# EAGLE design serparallel (EAGLE 6.1)
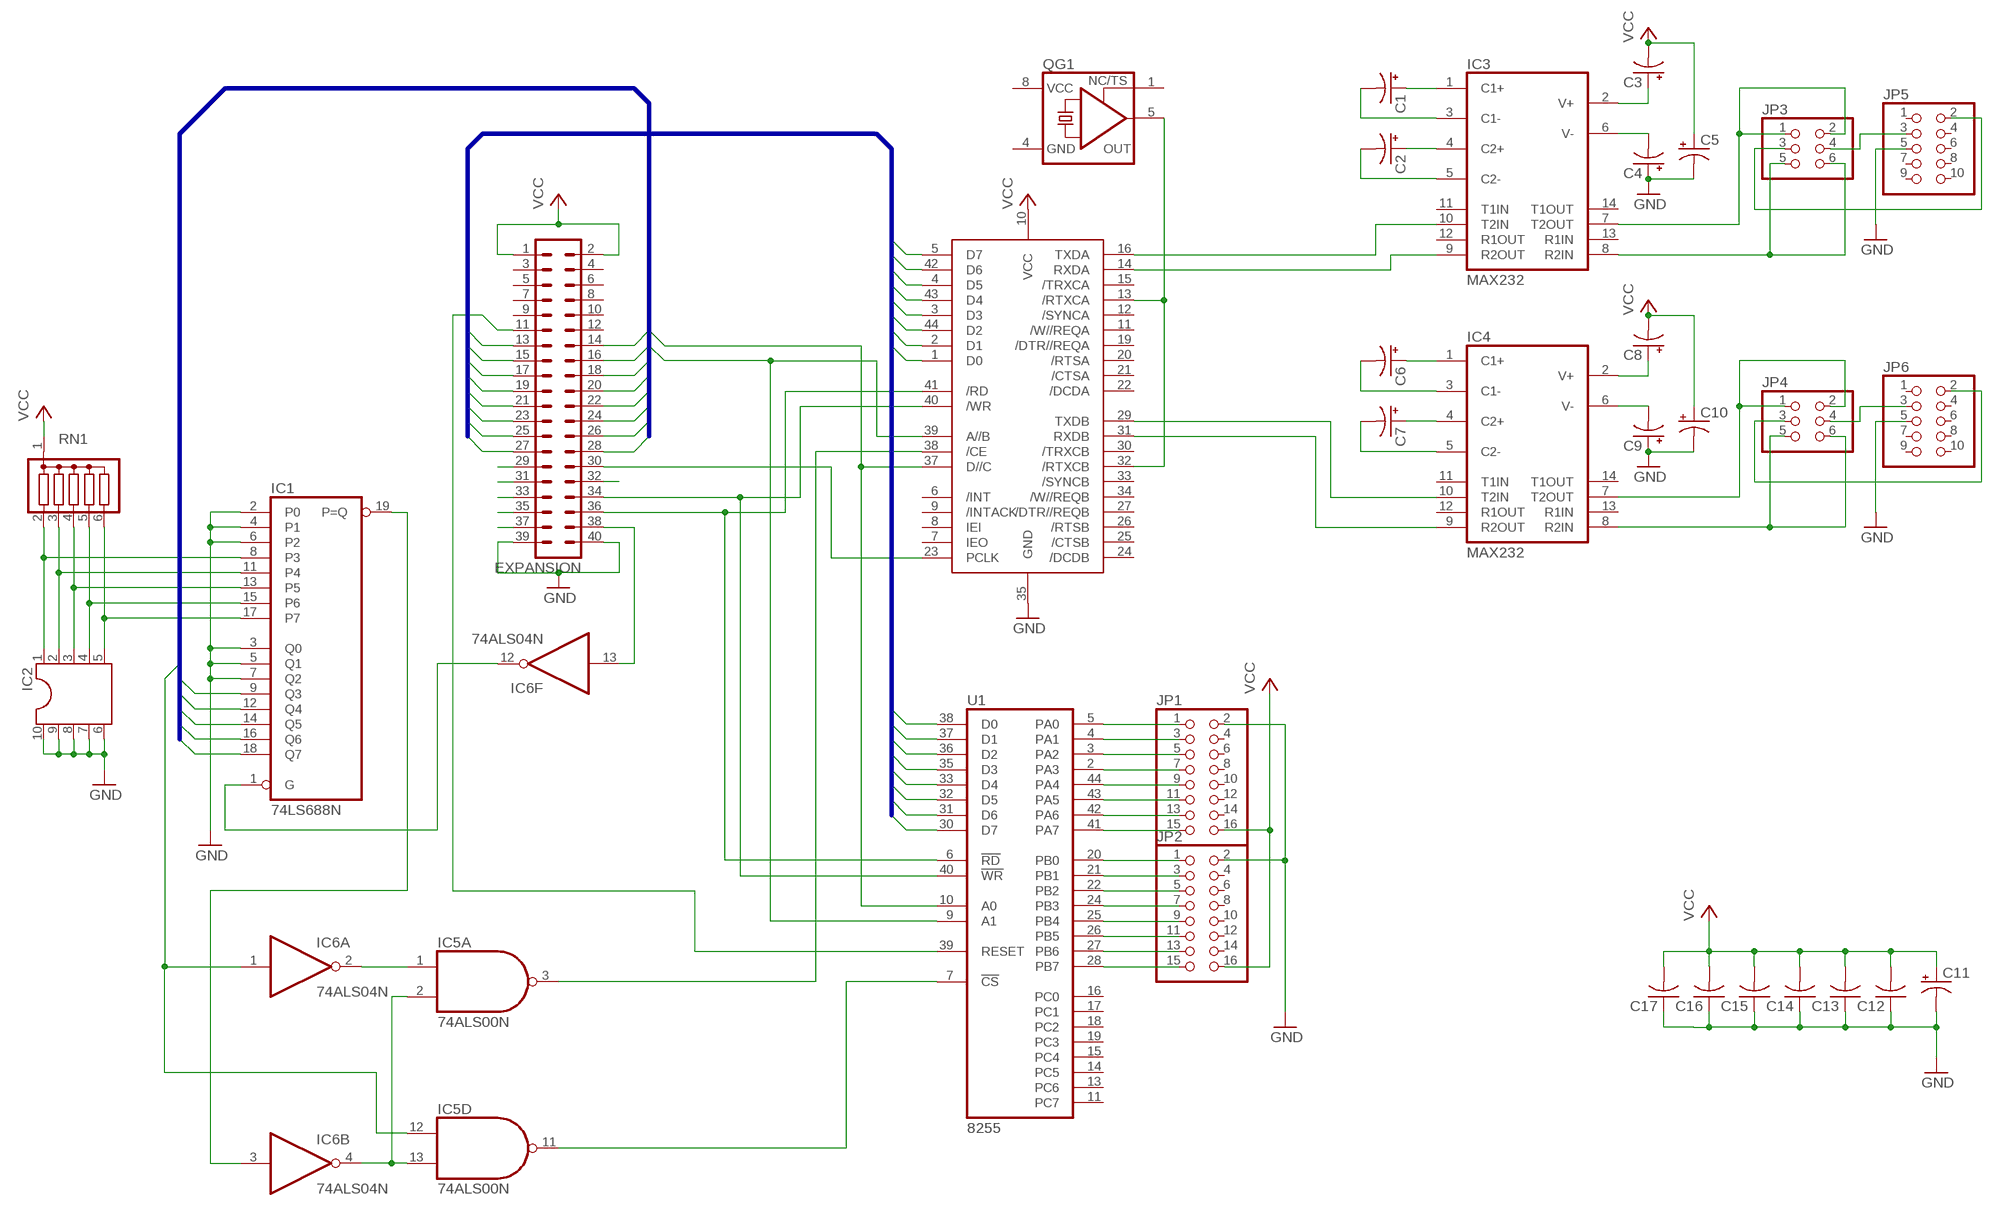
[diagram p0: schematic, sheet 1]

## Parts
C1  CPOL-USE2,5-6E  [E2,5-6E]
C2  CPOL-USE2,5-6E  [E2,5-6E]
C3  CPOL-USE2,5-6E  [E2,5-6E]
C4  CPOL-USE2,5-6E  [E2,5-6E]
C5  CPOL-USE2,5-6E  [E2,5-6E]
C6  CPOL-USE2,5-6E  [E2,5-6E]
C7  CPOL-USE2,5-6E  [E2,5-6E]
C8  CPOL-USE2,5-6E  [E2,5-6E]
C9  CPOL-USE2,5-6E  [E2,5-6E]
C10  CPOL-USE2,5-6E  [E2,5-6E]
C11  CPOL-USE15-6AXIAL  [E15-6]
C12  C-US075-032X103  [C075-032X103]
C13  C-US075-032X103  [C075-032X103]
C14  C-US075-032X103  [C075-032X103]
C15  C-US075-032X103  [C075-032X103]
C16  C-US075-032X103  [C075-032X103]
C17  C-US075-032X103  [C075-032X103]
EXPANSION  MA20-2W  [MA20-2W]
IC1  74LS688N  [DIL20]
IC2  DIL10  [DIL10]
IC3  MAX232  [DIL16]
IC4  MAX232  [DIL16]
IC5  74ALS00N  [DIL14]
IC6  74ALS04N  [DIL14]
JP1  PINHD-2X8/90  [2X08/90]
JP2  PINHD-2X8/90  [2X08/90]
JP3  PINHD-2X3  [2X03]
JP4  PINHD-2X3  [2X03]
JP5  PINHD-2X5/90  [2X05/90]
JP6  PINHD-2X5/90  [2X05/90]
QG1  XO-8  [DIL08S]
RN1  G05R  [SIL6]
U1  8255  82C55APLCC44  [S44]
U2  Z8530  [S44]

## Nets
/RD: EXPANSION.36 U1.6(!RD) U2.41(/RD)
/WR: EXPANSION.34 U1.40(!WR) U2.40(/WR)
ADDRESS8: EXPANSION.14 U1.10(A0) U2.37(D//C)
ADDRESS9: EXPANSION.16 U1.9(A1) U2.39(A//B)
ADDRESS10: EXPANSION.18 IC5.12(D:I0) IC6.1(A:I)
ADDRESS11: EXPANSION.20 IC1.9(Q3)
ADDRESS12: EXPANSION.22 IC1.12(Q4)
ADDRESS13: EXPANSION.24 IC1.14(Q5)
ADDRESS14: EXPANSION.26 IC1.16(Q6)
ADDRESS15: EXPANSION.28 IC1.18(Q7)
ALE: EXPANSION.32
CLKOUT: EXPANSION.30 U2.23(PCLK)
DATA0: EXPANSION.27 U1.38(D0) U2.1(D0)
DATA1: EXPANSION.25 U1.37(D1) U2.2(D1)
DATA2: EXPANSION.23 U1.36(D2) U2.44(D2)
DATA3: EXPANSION.21 U1.35(D3) U2.3(D3)
DATA4: EXPANSION.19 U1.33(D4) U2.43(D4)
DATA5: EXPANSION.17 U1.32(D5) U2.4(D5)
DATA6: EXPANSION.15 U1.31(D6) U2.42(D6)
DATA7: EXPANSION.13 U1.30(D7) U2.5(D7)
GND: C4.+ C5.- C9.+ C10.- C11.- C12.1 C13.1 C14.1 C15.1 C16.1 C17.1 EXPANSION.39 EXPANSION.40 IC1.2(P0) IC1.3(Q0) IC1.4(P1) IC1.5(Q1) IC1.6(P2) IC1.7(Q2) IC2.6 IC2.7 IC2.8 IC2.9 IC2.10 JP1.2 JP2.2 JP5.5 JP6.5 U2.35(GND)
INTBUS0: EXPANSION.37
INTBUS1: EXPANSION.35
INTBUS2: EXPANSION.33
INTBUS3: EXPANSION.31
INTBUS4: EXPANSION.29
IO/M: EXPANSION.38 IC6.13(F:I)
N$1: IC1.8(P3) IC2.1 RN1.2
N$2: IC1.11(P4) IC2.2 RN1.3
N$3: IC1.13(P5) IC2.3 RN1.4
N$4: IC1.15(P6) IC2.4 RN1.5
N$5: IC1.17(P7) IC2.5 RN1.6
N$6: IC5.1(A:I0) IC6.2(A:O)
N$7: IC5.2(A:I1) IC5.13(D:I1) IC6.4(B:O)
N$9: C1.+ IC3.1(C1+)
N$10: C1.- IC3.3(C1-)
N$11: C2.+ IC3.4(C2+)
N$12: C2.- IC3.5(C2-)
N$13: C3.+ IC3.2(V+)
N$14: C4.- IC3.6(V-)
N$15: C6.+ IC4.1(C1+)
N$16: IC5.3(A:O) U2.38(/CE)
N$17: C6.- IC4.3(C1-)
N$18: C7.+ IC4.4(C2+)
N$19: C7.- IC4.5(C2-)
N$20: C8.+ IC4.2(V+)
N$21: C9.- IC4.6(V-)
N$22: QG1.5(OUT) U2.13(/RTXCA) U2.32(/RTXCB)
N$23: IC3.10(T2IN) U2.16(TXDA)
N$24: IC3.9(R2OUT) U2.14(RXDA)
N$25: JP3.4 JP5.3
N$26: JP3.3 JP5.2
N$27: IC3.8(R2IN) JP3.5 JP3.6
N$28: JP1.1 U1.5(PA0)
N$29: IC3.7(T2OUT) JP3.1 JP3.2
N$30: JP1.3 U1.4(PA1)
N$31: JP1.5 U1.3(PA2)
N$32: JP1.7 U1.2(PA3)
N$33: JP1.9 U1.44(PA4)
N$34: JP1.11 U1.43(PA5)
N$35: JP1.13 U1.42(PA6)
N$36: JP1.15 U1.41(PA7)
N$37: JP2.1 U1.20(PB0)
N$38: JP2.3 U1.21(PB1)
N$39: JP2.5 U1.22(PB2)
N$40: JP2.7 U1.24(PB3)
N$41: JP2.9 U1.25(PB4)
N$42: JP2.11 U1.26(PB5)
N$43: JP2.13 U1.27(PB6)
N$44: JP2.15 U1.28(PB7)
N$45: IC5.11(D:O) U1.7(!CS)
N$47: IC1.19(P=Q) IC6.3(B:I)
N$49: IC1.1(G) IC6.12(F:O)
N$53: JP4.4 JP6.3
N$54: JP4.3 JP6.2
N$55: IC4.7(T2OUT) JP4.1 JP4.2
N$56: IC4.8(R2IN) JP4.5 JP4.6
N$57: IC4.10(T2IN) U2.29(TXDB)
N$58: IC4.9(R2OUT) U2.31(RXDB)
RESOUT: EXPANSION.11 U1.39(RESET)
VCC: C3.- C5.+ C8.- C10.+ C11.+ C12.2 C13.2 C14.2 C15.2 C16.2 C17.2 EXPANSION.1 EXPANSION.2 JP1.16 JP2.16 RN1.1 U2.10(VCC)
Unconnected: EXPANSION.3 EXPANSION.4 EXPANSION.5 EXPANSION.6 EXPANSION.7 EXPANSION.8 EXPANSION.9 EXPANSION.10 EXPANSION.12 IC3.11(T1IN) IC3.12(R1OUT) IC3.13(R1IN) IC3.14(T1OUT) IC4.11(T1IN) IC4.12(R1OUT) IC4.13(R1IN) IC4.14(T1OUT) IC5.4(B:I0) IC5.5(B:I1) IC5.6(B:O) IC5.8(C:O) IC5.9(C:I0) IC5.10(C:I1) IC6.5(C:I) IC6.6(C:O) IC6.8(D:O) IC6.9(D:I) IC6.10(E:O) IC6.11(E:I) JP1.4 JP1.6 JP1.8 JP1.10 JP1.12 JP1.14 JP2.4 JP2.6 JP2.8 JP2.10 JP2.12 JP2.14 JP5.1 JP5.4 JP5.6 JP5.7 JP5.8 JP5.9 JP5.10 JP6.1 JP6.4 JP6.6 JP6.7 JP6.8 JP6.9 JP6.10 QG1.1(TS) U1.11(PC7) U1.13(PC6) U1.14(PC5) U1.15(PC4) U1.16(PC0) U1.17(PC1) U1.18(PC2) U1.19(PC3) U2.6(/INT) U2.7(IEO) U2.8(IEI) U2.9(/INTACK) U2.11(/W//REQA) U2.12(/SYNCA) U2.15(/TRXCA) U2.19(/DTR//REQA) U2.20(/RTSA) U2.21(/CTSA) U2.22(/DCDA) U2.24(/DCDB) U2.25(/CTSB) U2.26(/RTSB) U2.27(/DTR//REQB) U2.30(/TRXCB) U2.33(/SYNCB) U2.34(/W//REQB)

## Buses
DATA
ADDRESS

## Power pins joined to a net without a drawn wire
GND: IC1.10(GND) IC3.15(GND) IC4.15(GND) IC5.7(P:GND) IC6.7(P:GND) QG1.4(GND) U1.8(GND)
VCC: IC1.20(VCC) IC3.16(VCC) IC4.16(VCC) IC5.14(P:VCC) IC6.14(P:VCC) QG1.8(VCC) U1.29(VCC)

## Library data of the parts
C1-C11 = resistor:CPOL-US: POLARIZED CAPACITOR, American symbol
C12-C17 = resistor:C-US: CAPACITOR, American symbol
EXPANSION = con-lstb:MA20-2W: PIN HEADER
IC1 = 74xx-us:74*688: 8-bit MAGNITUDE/IDENTITY COMPARATOR, totem pole
IC2 = ic-package:DIL10: Dual In Line / Socket
IC3 IC4 = maxim:MAX232: RS232 TRANSEIVER
IC5 = 74xx-us:74*00: Quad 2-input NAND gate
IC6 = 74xx-us:74*04: Hex INVERTER
JP1 JP2 = pinhead:PINHD-2X8: PIN HEADER
JP3 JP4 = pinhead:PINHD-2X3: PIN HEADER
JP5 JP6 = pinhead:PINHD-2X5: PIN HEADER
QG1 = crystal:XO-: CRYSTAL
RN1 = resistor-sil:G05R: SIL RESISTOR
U1 = plcc-socketed-devs:82C55A: MICROCONTROLLER/MEMORY DEVICE
U2 = plcc-socketed-devs:Z8530: Zilog 8530 SCC in PLCC socket

## Board
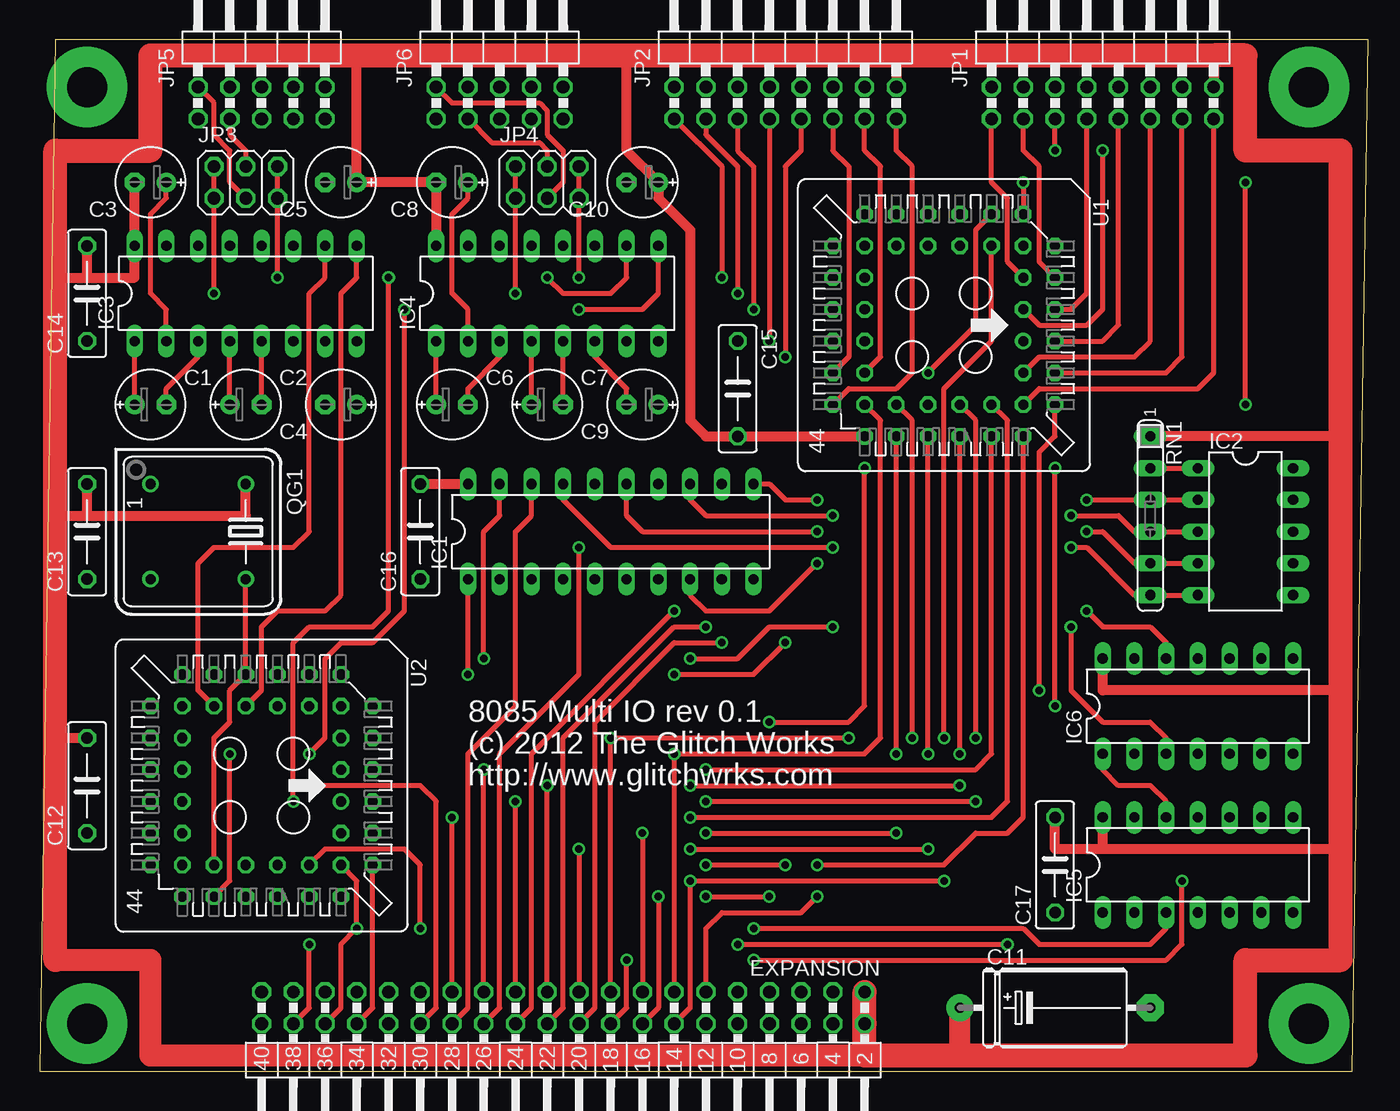
[diagram p1: board, top side]
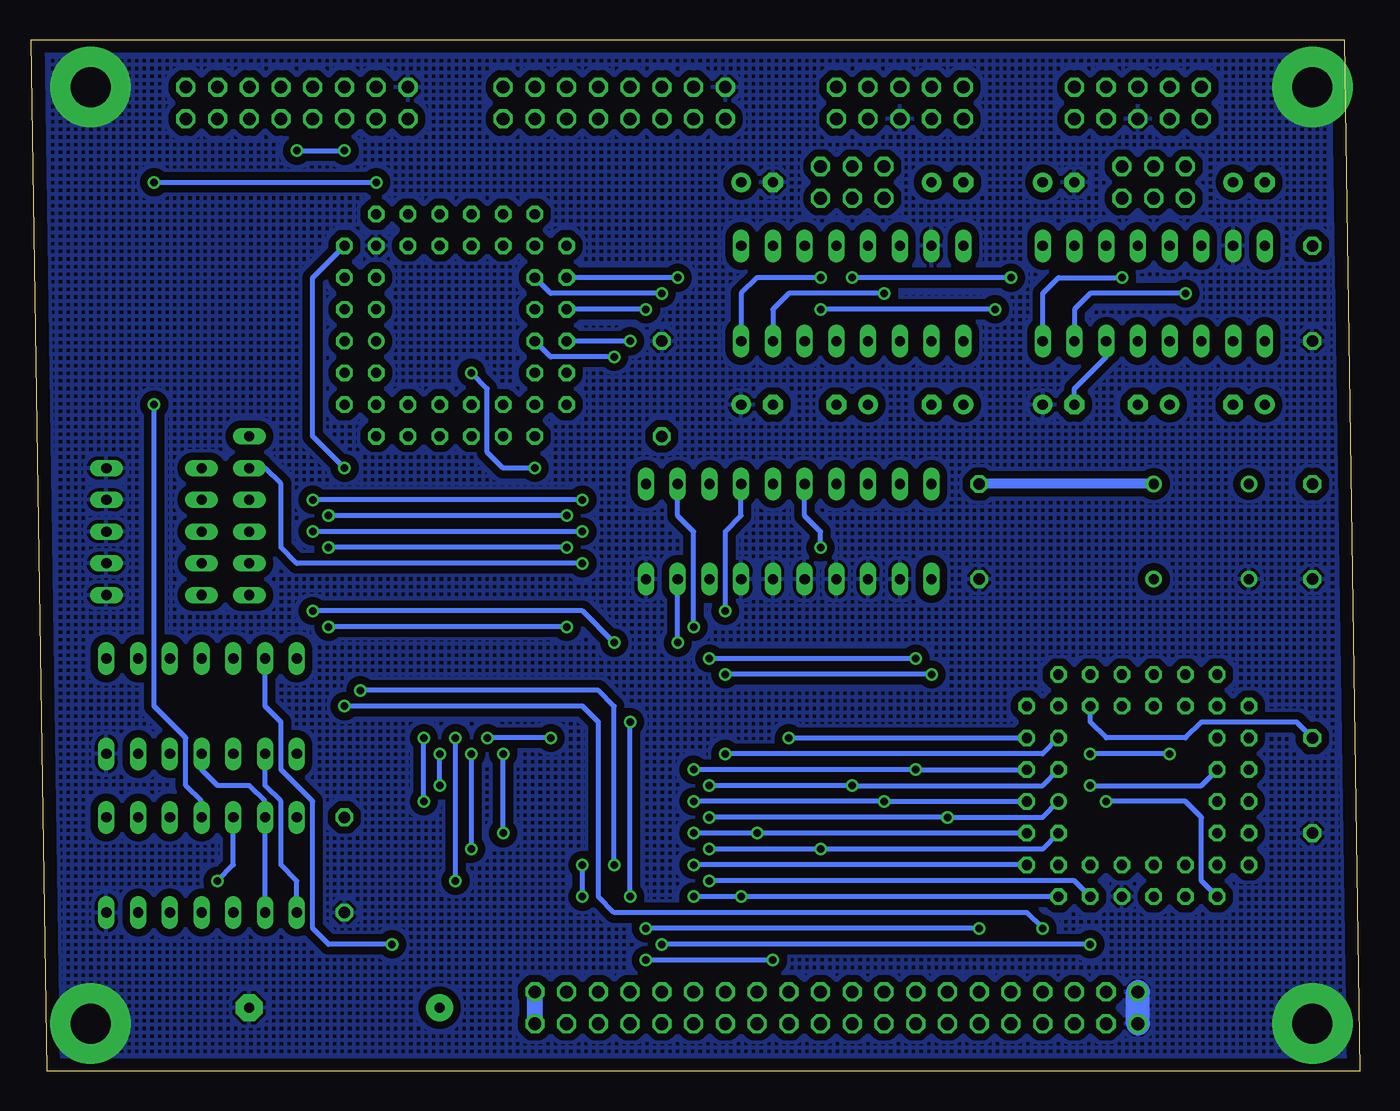
[diagram p2: board, bottom side, seen from below]

Size 106.35 x 82.54 mm. Coordinates in mm from the lower left corner, seen from the top.
Outline: 0,0 105.08,0 106.35,82.54 1.27,82.54 0,0
Copper layers (1*16): Top 0.035mm / dielectric 1.5mm / Bottom 0.035mm
Design rules: minimum track width 10mil, minimum drill 15mil, track to track 8mil, track to pad 8mil, pad to pad 8mil, via to via 8mil, smd to smd 8mil, copper to edge 40mil, drill to drill 8mil, minimum pad ring 10mil, minimum via ring 8mil, stop-mask expansion 4mil, vias tented up to drill 0mil, thermal gap 10mil

### Footprints (pad centres in the part's own frame; a part is rotated, then mirrored left to right if it is on the bottom)
E2,5-6E = drill 0.813 pad 1.575: + -1.27,0 | drill 0.813 pad 1.575 octagon: - 1.27,0
E15-6 = drill 0.813 pad 2.159: + -7.62,0 | drill 0.813 pad 2.159 octagon: - 7.62,0
C075-032X103 = drill 0.914 octagon: 1 -3.81,0; 2 3.81,0
MA20-2W = drill 1.016 octagon: 1 -24.13,-1.27; 2 -24.13,1.27; 3 -21.59,-1.27; 4 -21.59,1.27; 5 -19.05,-1.27; 6 -19.05,1.27; 7 -16.51,-1.27; 8 -16.51,1.27; 9 -13.97,-1.27; 10 -13.97,1.27; 11 -11.43,-1.27; 12 -11.43,1.27; 13 -8.89,-1.27; 14 -8.89,1.27; 15 -6.35,-1.27; 16 -6.35,1.27; 17 -3.81,-1.27; 18 -3.81,1.27; 19 -1.27,-1.27; 20 -1.27,1.27; 21 1.27,-1.27; 22 1.27,1.27; 23 3.81,-1.27; 24 3.81,1.27; 25 6.35,-1.27; 26 6.35,1.27; 27 8.89,-1.27; 28 8.89,1.27; 29 11.43,-1.27; 30 11.43,1.27; 31 13.97,-1.27; 32 13.97,1.27; 33 16.51,-1.27; 34 16.51,1.27; 35 19.05,-1.27; 36 19.05,1.27; 37 21.59,-1.27; 38 21.59,1.27; 39 24.13,-1.27; 40 24.13,1.27
DIL20 = drill 0.813 long: 1 -11.43,-3.81; 2 -8.89,-3.81; 3 -6.35,-3.81; 4 -3.81,-3.81; 5 -1.27,-3.81; 6 1.27,-3.81; 7 3.81,-3.81; 8 6.35,-3.81; 9 8.89,-3.81; 10 11.43,-3.81; 11 11.43,3.81; 12 8.89,3.81; 13 6.35,3.81; 14 3.81,3.81; 15 1.27,3.81; 16 -1.27,3.81; 17 -3.81,3.81; 18 -6.35,3.81; 19 -8.89,3.81; 20 -11.43,3.81
DIL10 = drill 0.813 long: 1 -5.08,-3.81; 2 -2.54,-3.81; 3 0,-3.81; 4 2.54,-3.81; 5 5.08,-3.81; 6 5.08,3.81; 7 2.54,3.81; 8 0,3.81; 9 -2.54,3.81; 10 -5.08,3.81
DIL16 = drill 0.813 long: 1 -8.89,-3.81; 2 -6.35,-3.81; 3 -3.81,-3.81; 4 -1.27,-3.81; 5 1.27,-3.81; 6 3.81,-3.81; 7 6.35,-3.81; 8 8.89,-3.81; 9 8.89,3.81; 10 6.35,3.81; 11 3.81,3.81; 12 1.27,3.81; 13 -1.27,3.81; 14 -3.81,3.81; 15 -6.35,3.81; 16 -8.89,3.81
DIL14 = drill 0.813 long: 1 -7.62,-3.81; 2 -5.08,-3.81; 3 -2.54,-3.81; 4 0,-3.81; 5 2.54,-3.81; 6 5.08,-3.81; 7 7.62,-3.81; 8 7.62,3.81; 9 5.08,3.81; 10 2.54,3.81; 11 0,3.81; 12 -2.54,3.81; 13 -5.08,3.81; 14 -7.62,3.81
2X08/90 = drill 1.016 octagon: 1 -8.89,-6.35; 2 -8.89,-3.81; 3 -6.35,-6.35; 4 -6.35,-3.81; 5 -3.81,-6.35; 6 -3.81,-3.81; 7 -1.27,-6.35; 8 -1.27,-3.81; 9 1.27,-6.35; 10 1.27,-3.81; 11 3.81,-6.35; 12 3.81,-3.81; 13 6.35,-6.35; 14 6.35,-3.81; 15 8.89,-6.35; 16 8.89,-3.81
2X03 = drill 1.016 octagon: 1 -2.54,-1.27; 2 -2.54,1.27; 3 0,-1.27; 4 0,1.27; 5 2.54,-1.27; 6 2.54,1.27
2X05/90 = drill 1.016 octagon: 1 -5.08,-6.35; 2 -5.08,-3.81; 3 -2.54,-6.35; 4 -2.54,-3.81; 5 0,-6.35; 6 0,-3.81; 7 2.54,-6.35; 8 2.54,-3.81; 9 5.08,-6.35; 10 5.08,-3.81
DIL08S = drill 0.813: 1 -3.81,-3.81; 4 3.81,-3.81; 5 3.81,3.81; 8 -3.81,3.81
SIL6 = drill 0.813 long: 1 -6.35,0; 2 -3.81,0; 3 -1.27,0; 4 1.27,0; 5 3.81,0; 6 6.35,0
S44 = drill 0.813: 1 1.27,6.35 | drill 0.813 octagon: 2 -1.27,8.89; 3 -1.27,6.35; 4 -3.81,8.89; 5 -3.81,6.35; 6 -6.35,8.89; 7 -8.89,6.35; 8 -6.35,6.35; 9 -8.89,3.81; 10 -6.35,3.81; 11 -8.89,1.27; 12 -6.35,1.27; 13 -8.89,-1.27; 14 -6.35,-1.27; 15 -8.89,-3.81; 16 -6.35,-3.81; 17 -8.89,-6.35; 18 -6.35,-8.89; 19 -6.35,-6.35; 20 -3.81,-8.89; 21 -3.81,-6.35; 22 -1.27,-8.89; 23 -1.27,-6.35; 24 1.27,-8.89; 25 1.27,-6.35; 26 3.81,-8.89; 27 3.81,-6.35; 28 6.35,-8.89; 29 8.89,-6.35; 30 6.35,-6.35; 31 8.89,-3.81; 32 6.35,-3.81; 33 8.89,-1.27; 34 6.35,-1.27; 35 8.89,1.27; 36 6.35,1.27; 37 8.89,3.81; 38 6.35,3.81; 39 8.89,6.35; 40 6.35,8.89; 41 6.35,6.35; 42 3.81,8.89; 43 3.81,6.35; 44 1.27,8.89

### Placement (x,y rotation side)
C1  8.89,53.34 0 top
C2  16.51,53.34 0 top
C3  8.89,71.12 180 top
C4  24.13,53.34 180 top
C5  24.13,71.12 180 top
C6  33.02,53.34 0 top
C7  40.64,53.34 0 top
C8  33.02,71.12 180 top
C9  48.26,53.34 180 top
C10  48.26,71.12 180 top
C11  81.28,5.08 0 top
C12  3.81,22.86 90 top
C13  3.81,43.18 90 top
C14  3.81,62.23 90 top
C15  55.88,54.61 270 top
C16  30.48,43.18 90 top
C17  81.28,16.51 90 top
EXPANSION  41.91,5.08 180 top
IC1  45.72,43.18 0 top
IC2  96.52,43.18 270 top
IC3  16.51,62.23 0 top
IC4  40.64,62.23 0 top
IC5  92.71,16.51 0 top
IC6  92.71,29.21 0 top
JP1  85.09,82.55 0 top
JP2  59.69,82.55 0 top
JP3  16.51,71.12 0 top
JP4  40.64,71.12 0 top
JP5  17.78,82.55 0 top
JP6  36.83,82.55 0 top
QG1  12.7,43.18 270 top
RN1  88.9,44.45 270 top
U1  72.39,59.69 270 top
U2  17.78,22.86 270 top

### Tracks (layer width: path | path; a pad name or v marks a point on that pad's centre or on a via)
/RD  (via drill 0.6)
  Top 0.406: EXPANSION.36 24.13,5.08 24.13,10.16 v25.4,11.43 25.4,15.24 U2.41 | v81.28,29.21 v81.28,48.26
  Bottom 0.406: U1.6 83.82,63.5 83.82,50.8 v81.28,48.26 | v81.28,29.21 62.23,29.21 60.96,27.94 60.96,13.97 59.69,12.7 26.67,12.7 v25.4,11.43
/WR  (via drill 0.6)
  Top 0.406: EXPANSION.34 26.67,5.08 U2.40 | v53.34,16.51 v59.69,16.51 | v80.01,30.48 80.01,49.53 81.28,50.8 U1.40
  Bottom 0.406: U2.40 v53.34,16.51 | v59.69,16.51 59.69,29.21 60.96,30.48 v80.01,30.48
ADDRESS8  (via drill 0.6)
  Top 0.406: U1.10 76.2,58.42 72.39,54.61 v72.39,26.67 | v72.39,15.24 v52.07,15.24 52.07,5.08 EXPANSION.14
  Bottom 0.406: v52.07,15.24 22.86,15.24 U2.37 | v72.39,15.24 v72.39,26.67
ADDRESS9  (via drill 0.6)
  Top 0.406: v49.53,13.97 49.53,5.08 EXPANSION.16 | U1.9 74.93,67.31 74.93,59.69 v71.12,55.88 | v53.34,13.97 v58.42,13.97 | v66.04,48.26 66.04,29.21 64.77,27.94 v58.42,27.94
  Bottom 0.406: U2.39 v49.53,13.97 v53.34,13.97 | v66.04,48.26 68.58,48.26 69.85,49.53 69.85,54.61 v71.12,55.88 | v58.42,13.97 v58.42,27.94
ADDRESS10  (via drill 0.6)
  Top 0.406: IC5.12 90.17,21.59 88.9,22.86 86.36,22.86 85.09,24.13 IC6.1 | EXPANSION.18 46.99,5.08 v46.99,8.89 | v57.15,8.89 90.17,8.89 91.44,10.16 v91.44,15.24
  Bottom 0.406: v46.99,8.89 v57.15,8.89 | v91.44,15.24 90.17,16.51 IC5.12
ADDRESS11  (via drill 0.6)
  Top 0.406: EXPANSION.20 44.45,5.08 44.45,27.94 50.8,34.29 v54.61,34.29
  Bottom 0.406: v54.61,34.29 IC1.9
ADDRESS12  (via drill 0.6)
  Top 0.406: EXPANSION.22 41.91,5.08 41.91,26.67 50.8,35.56 v53.34,35.56
  Bottom 0.406: v53.34,35.56 53.34,43.18 54.61,44.45 IC1.12
ADDRESS13  (via drill 0.6)
  Top 0.406: EXPANSION.24 39.37,5.08 39.37,25.4 v50.8,36.83
  Bottom 0.406: v50.8,36.83 50.8,43.18 49.53,44.45 IC1.14
ADDRESS14  (via drill 0.6)
  Top 0.406: EXPANSION.26 36.83,5.08 36.83,25.4 43.18,31.75 v43.18,41.91
  Bottom 0.406: v43.18,41.91 43.18,43.18 44.45,44.45 IC1.16
ADDRESS15
  Top 0.406: EXPANSION.28 34.29,5.08 34.29,25.4 38.1,29.21 38.1,43.18 39.37,44.45 IC1.18
CLKOUT  (via drill 0.6)
  Top 0.406: EXPANSION.30 31.75,5.08 31.75,21.59 30.48,22.86 v21.59,22.86
  Bottom 0.406: v21.59,22.86 12.7,22.86 U2.23
DATA0  (via drill 0.6)
  Top 0.406: EXPANSION.27 v33.02,20.32 | U1.38 77.47,52.07 77.47,21.59 76.2,20.32 v52.07,20.32
  Bottom 0.406: U2.1 25.4,20.32 v33.02,20.32 v52.07,20.32
DATA1  (via drill 0.6)
  Top 0.406: EXPANSION.25 v35.56,24.13 | U1.37 76.2,25.4 74.93,24.13 v53.34,24.13
  Bottom 0.406: U2.2 v35.56,24.13 v53.34,24.13
DATA2  (via drill 0.6)
  Top 0.406: EXPANSION.23 v38.1,21.59 | U1.36 74.93,52.07 v74.93,26.67 | v53.34,21.59 v74.93,21.59
  Bottom 0.406: U2.44 v38.1,21.59 v53.34,21.59 | v74.93,21.59 v74.93,26.67
DATA3  (via drill 0.6)
  Top 0.406: EXPANSION.21 v40.64,22.86 | v73.66,25.4 U1.35 | v52.07,22.86 v73.66,22.86
  Bottom 0.406: U2.3 25.4,22.86 v40.64,22.86 v52.07,22.86 | v73.66,22.86 v73.66,25.4
DATA4  (via drill 0.6)
  Top 0.406: v43.18,17.78 EXPANSION.19 | v71.12,25.4 U1.33 | v52.07,17.78 v71.12,17.78
  Bottom 0.406: U2.43 25.4,17.78 v43.18,17.78 v52.07,17.78 | v71.12,17.78 v71.12,25.4
DATA5  (via drill 0.6)
  Top 0.406: EXPANSION.17 v45.72,26.67 v64.77,26.67 | U1.32 69.85,52.07 v69.85,26.67
  Bottom 0.406: v45.72,26.67 U2.4 | v64.77,26.67 v69.85,26.67
DATA6  (via drill 0.6)
  Top 0.406: v48.26,19.05 EXPANSION.15 | v68.58,25.4 U1.31 | v53.34,19.05 v68.58,19.05
  Bottom 0.406: U2.42 v48.26,19.05 v53.34,19.05 | v68.58,19.05 v68.58,25.4
DATA7  (via drill 0.6)
  Top 0.406: EXPANSION.13 v50.8,25.4 66.04,25.4 67.31,26.67 67.31,52.07 U1.30
  Bottom 0.406: v50.8,25.4 25.4,25.4 U2.5
GND  (via drill 3.2 pad 6.45)
  Bottom 1.93: EXPANSION.40 EXPANSION.39
  other vias: 101.6,3.81 3.81,3.81 3.81,78.74 101.6,78.74
  pour Bottom (isolate 0.61, hatched): 0,82.55 105.41,82.55 105.41,0 0,0
IO/M  (via drill 0.6)
  Top 0.406: v55.88,10.16 v77.47,10.16 | v21.59,10.16 21.59,5.08 EXPANSION.38
  Bottom 0.406: IC6.13 87.63,29.21 86.36,27.94 86.36,24.13 83.82,21.59 83.82,11.43 82.55,10.16 v77.47,10.16 | v21.59,10.16 v55.88,10.16
N$1  (via drill 0.6)
  Top 0.406: RN1.2 IC2.1 | v62.23,40.64 58.42,36.83 53.34,36.83 52.07,38.1 IC1.8
  Bottom 0.406: v62.23,40.64 85.09,40.64 86.36,41.91 86.36,46.99 87.63,48.26 RN1.2
N$2  (via drill 0.6)
  Top 0.406: IC2.2 RN1.3 v83.82,45.72 | IC1.11 58.42,46.99 59.69,45.72 v62.23,45.72
  Bottom 0.406: v62.23,45.72 v83.82,45.72
N$3  (via drill 0.6)
  Top 0.406: IC2.3 RN1.4 87.63,43.18 86.36,44.45 v82.55,44.45 | IC1.13 52.07,45.72 53.34,44.45 v63.5,44.45
  Bottom 0.406: v63.5,44.45 v82.55,44.45
N$4  (via drill 0.6)
  Top 0.406: IC2.4 RN1.5 87.63,40.64 85.09,43.18 v83.82,43.18 | IC1.15 46.99,44.45 48.26,43.18 v62.23,43.18
  Bottom 0.406: v62.23,43.18 v83.82,43.18
N$5  (via drill 0.6)
  Top 0.406: IC2.5 RN1.6 87.63,38.1 83.82,41.91 v82.55,41.91 | IC1.17 41.91,45.72 45.72,41.91 v63.5,41.91
  Bottom 0.406: v63.5,41.91 v82.55,41.91
N$6
  Bottom 0.406: IC6.2 87.63,22.86 86.36,21.59 86.36,16.51 85.09,15.24 IC5.1
N$7
  Bottom 0.406: IC6.4 92.71,24.13 91.44,22.86 88.9,22.86 87.63,21.59 IC5.13 IC5.2
N$9
  Top 0.406: C1.+ IC3.1
N$10
  Top 0.406: C1.- 10.16,54.61 12.7,57.15 IC3.3
N$11
  Top 0.406: C2.+ IC3.4
N$12
  Top 0.406: C2.- IC3.5
N$13
  Top 0.406: C3.+ 10.16,69.85 8.89,68.58 8.89,62.23 10.16,60.96 IC3.2
N$14
  Bottom 0.406: C4.- 22.86,54.61 20.32,57.15 IC3.6
N$15
  Top 0.406: C6.+ IC4.1
N$16  (via drill 0.6)
  Top 0.406: v57.15,11.43 78.74,11.43 80.01,10.16 88.9,10.16 90.17,11.43 IC5.3 | v30.48,11.43 30.48,16.51 29.21,17.78 22.86,17.78 U2.38
  Bottom 0.406: v30.48,11.43 v57.15,11.43
N$17
  Top 0.406: C6.- 34.29,54.61 36.83,57.15 IC4.3
N$18
  Top 0.406: C7.+ IC4.4
N$19
  Top 0.406: C7.- IC4.5
N$20
  Top 0.406: C8.+ 34.29,69.85 33.02,68.58 33.02,62.23 34.29,60.96 IC4.2
N$21
  Top 0.406: C9.- 46.99,54.61 44.45,57.15 IC4.6
N$22
  Top 0.406: QG1.5 U2.13 15.24,30.48 15.24,27.94 13.97,26.67 U2.32
N$23
  Top 0.406: U2.16 12.7,30.48 12.7,40.64 13.97,41.91 20.32,41.91 21.59,43.18 21.59,62.23 22.86,63.5 IC3.10
N$24
  Top 0.406: U2.14 17.78,30.48 17.78,35.56 19.05,36.83 22.86,36.83 24.13,38.1 24.13,62.23 25.4,63.5 IC3.9
N$25
  Top 0.406: JP5.3 15.24,74.93 16.51,73.66 JP3.4
N$26
  Top 0.406: JP3.3 15.24,71.12 15.24,73.66 13.97,74.93 13.97,77.47 JP5.2
N$27  (via drill 0.6)
  Top 0.406: JP3.6 JP3.5 v19.05,63.5
  Bottom 0.406: v19.05,63.5 24.13,63.5 25.4,62.23 IC3.8
N$28
  Top 0.406: JP1.1 76.2,71.12 77.47,69.85 77.47,64.77 U1.5
N$29  (via drill 0.6)
  Top 0.406: JP3.2 JP3.1 v13.97,62.23
  Bottom 0.406: v13.97,62.23 21.59,62.23 22.86,60.96 IC3.7
N$30
  Top 0.406: JP1.3 78.74,73.66 80.01,72.39 80.01,64.77 U1.4
N$31  (via drill 0.6)
  Top 0.406: v81.28,73.66 JP1.5 | v85.09,73.66 85.09,60.96 83.82,59.69 80.01,59.69 U1.3
  Bottom 0.406: v85.09,73.66 v81.28,73.66
N$32
  Top 0.406: JP1.7 83.82,62.23 82.55,60.96 U1.2
N$33
  Top 0.406: JP1.9 86.36,59.69 85.09,58.42 U1.44
N$34
  Top 0.406: JP1.11 88.9,58.42 87.63,57.15 80.01,57.15 U1.43
N$35
  Top 0.406: JP1.13 91.44,57.15 90.17,55.88 U1.42
N$36
  Top 0.406: JP1.15 93.98,55.88 92.71,54.61 80.01,54.61 U1.41
N$37  (via drill 0.6)
  Top 0.406: JP2.1 54.61,72.39 v54.61,63.5
  Bottom 0.406: v54.61,63.5 U1.20
N$38  (via drill 0.6)
  Top 0.406: JP2.3 53.34,74.93 55.88,72.39 v55.88,62.23
  Bottom 0.406: v55.88,62.23 64.77,62.23 U1.21
N$39  (via drill 0.6)
  Top 0.406: JP2.5 55.88,73.66 57.15,72.39 v57.15,60.96
  Bottom 0.406: v57.15,60.96 U1.22
N$40  (via drill 0.6)
  Top 0.406: JP2.7 v58.42,58.42
  Bottom 0.406: v58.42,58.42 U1.24
N$41  (via drill 0.6)
  Top 0.406: JP2.9 60.96,73.66 59.69,72.39 v59.69,57.15
  Bottom 0.406: v59.69,57.15 64.77,57.15 U1.25
N$42
  Top 0.406: JP2.11 63.5,73.66 64.77,72.39 64.77,57.15 U1.26
N$43
  Top 0.406: U1.27 67.31,57.15 67.31,72.39 66.04,73.66 JP2.13
N$44
  Top 0.406: U1.28 64.77,54.61 68.58,54.61 69.85,55.88 69.85,72.39 68.58,73.66 JP2.15
N$45  (via drill 0.6)
  Top 0.406: v78.74,71.12 U1.7 | v96.52,53.34 v96.52,71.12
  Bottom 0.406: IC5.11 92.71,21.59 93.98,22.86 93.98,26.67 96.52,29.21 v96.52,53.34 | v96.52,71.12 v78.74,71.12
N$47  (via drill 0.6)
  Top 0.406: IC1.19 36.83,44.45 35.56,43.18 v35.56,33.02 | v82.55,35.56 82.55,30.48 85.09,27.94 88.9,27.94 90.17,26.67 IC6.3 | v52.07,33.02 55.88,33.02 58.42,35.56 v63.5,35.56
  Bottom 0.406: v35.56,33.02 v52.07,33.02 | v63.5,35.56 v82.55,35.56
N$49  (via drill 0.6)
  Top 0.406: IC6.12 90.17,34.29 88.9,35.56 85.09,35.56 v83.82,36.83 | v59.69,34.29 57.15,31.75 v50.8,31.75 | v34.29,31.75 IC1.1
  Bottom 0.406: v83.82,36.83 62.23,36.83 v59.69,34.29 | v34.29,31.75 v50.8,31.75
N$53
  Top 0.406: JP6.3 36.2,74.3 40.01,74.3 40.64,73.66 JP4.4
N$54
  Top 0.406: JP6.2 33.02,77.47 40.01,77.47 40.64,76.83 40.64,74.93 41.91,73.66 41.91,71.12 JP4.3
N$55  (via drill 0.6)
  Top 0.406: JP4.2 JP4.1 v38.1,62.23
  Bottom 0.406: IC4.7 46.99,60.96 45.72,62.23 v38.1,62.23
N$56  (via drill 0.6)
  Top 0.406: JP4.6 JP4.5 v43.18,63.5
  Bottom 0.406: IC4.8 49.53,62.23 48.26,63.5 v43.18,63.5
N$57  (via drill 0.6)
  Top 0.406: v20.32,21.59 20.32,34.29 21.59,35.56 26.67,35.56 27.94,36.83 v27.94,63.5 | v40.64,63.5 41.91,62.23 45.72,62.23 46.99,63.5 IC4.10
  Bottom 0.406: U2.29 12.7,15.24 12.7,20.32 13.97,21.59 v20.32,21.59 | v27.94,63.5 v40.64,63.5
N$58  (via drill 0.6)
  Top 0.406: v29.21,60.96 29.21,36.83 26.67,34.29 24.13,34.29 22.86,33.02 22.86,26.67 v21.59,25.4 | v43.18,60.96 48.26,60.96 49.53,62.23 IC4.9 | U2.31 15.24,15.24 v15.24,25.4
  Bottom 0.406: v29.21,60.96 v43.18,60.96 | v15.24,25.4 v21.59,25.4
RESOUT  (via drill 0.6)
  Top 0.406: U1.39 78.74,20.32 77.47,19.05 74.93,19.05 72.39,16.51 v62.23,16.51 | v62.23,13.97 60.96,12.7 54.61,12.7 53.34,11.43 EXPANSION.11
  Bottom 0.406: v62.23,13.97 v62.23,16.51
VCC
  Top 0.813: C3.- IC3.16 7.62,63.5 3.81,63.5 | 1.27,63.5 3.81,63.5 | IC4.16 C8.- C5.+ 25.4,81.28 | 3.81,63.5 C14.2 | QG1.8 16.51,44.45 3.81,44.45 | 1.27,26.67 C12.2 | 3.81,44.45 C13.2 | 1.27,44.45 3.81,44.45 | 104.14,50.8 RN1.1 | C16.2 IC1.20 | U1.29 C15.2 53.34,50.8 52.07,52.07 52.07,67.31 49.53,69.85 C10.+ 46.99,73.66 46.99,81.28 | 68.58,81.28 JP2.16 | 93.98,81.28 JP1.16 | C17.2 81.28,17.78 85.09,17.78 | 104.14,17.78 85.09,17.78 | 85.09,17.78 IC5.14 | IC6.14 85.09,30.48 104.14,30.48
  Top 1.676: 73.66,1.27 C11.+
  Top 1.778: 1.27,8.89 8.89,8.89 8.89,1.27 66.04,1.27
  Top 1.93: 1.27,8.89 1.27,26.67 1.27,44.45 1.27,63.5 1.27,73.66 8.89,73.66 8.89,81.28 25.4,81.28 46.99,81.28 68.58,81.28 93.98,81.28 96.52,81.28 96.52,73.66 104.14,73.66 104.14,50.8 104.14,30.48 104.14,17.78 104.14,8.89 96.52,8.89 96.52,1.27 73.66,1.27 66.04,1.27 EXPANSION.2 EXPANSION.1
  Bottom 0.406: U2.10 21.59,27.94 20.32,26.67 13.97,26.67 12.7,27.94 5.08,27.94 C12.2
  Bottom 0.813: QG1.8 C16.2
  Bottom 1.27: EXPANSION.2 EXPANSION.1

### Text on the board
tNames: 8085 Multi IO rev 0.1 | (c) 2012 The Glitch Works | http://www.glitchwrks.com